# EAGLE design Traction_Control_Standalone (EAGLE 9.1.3)
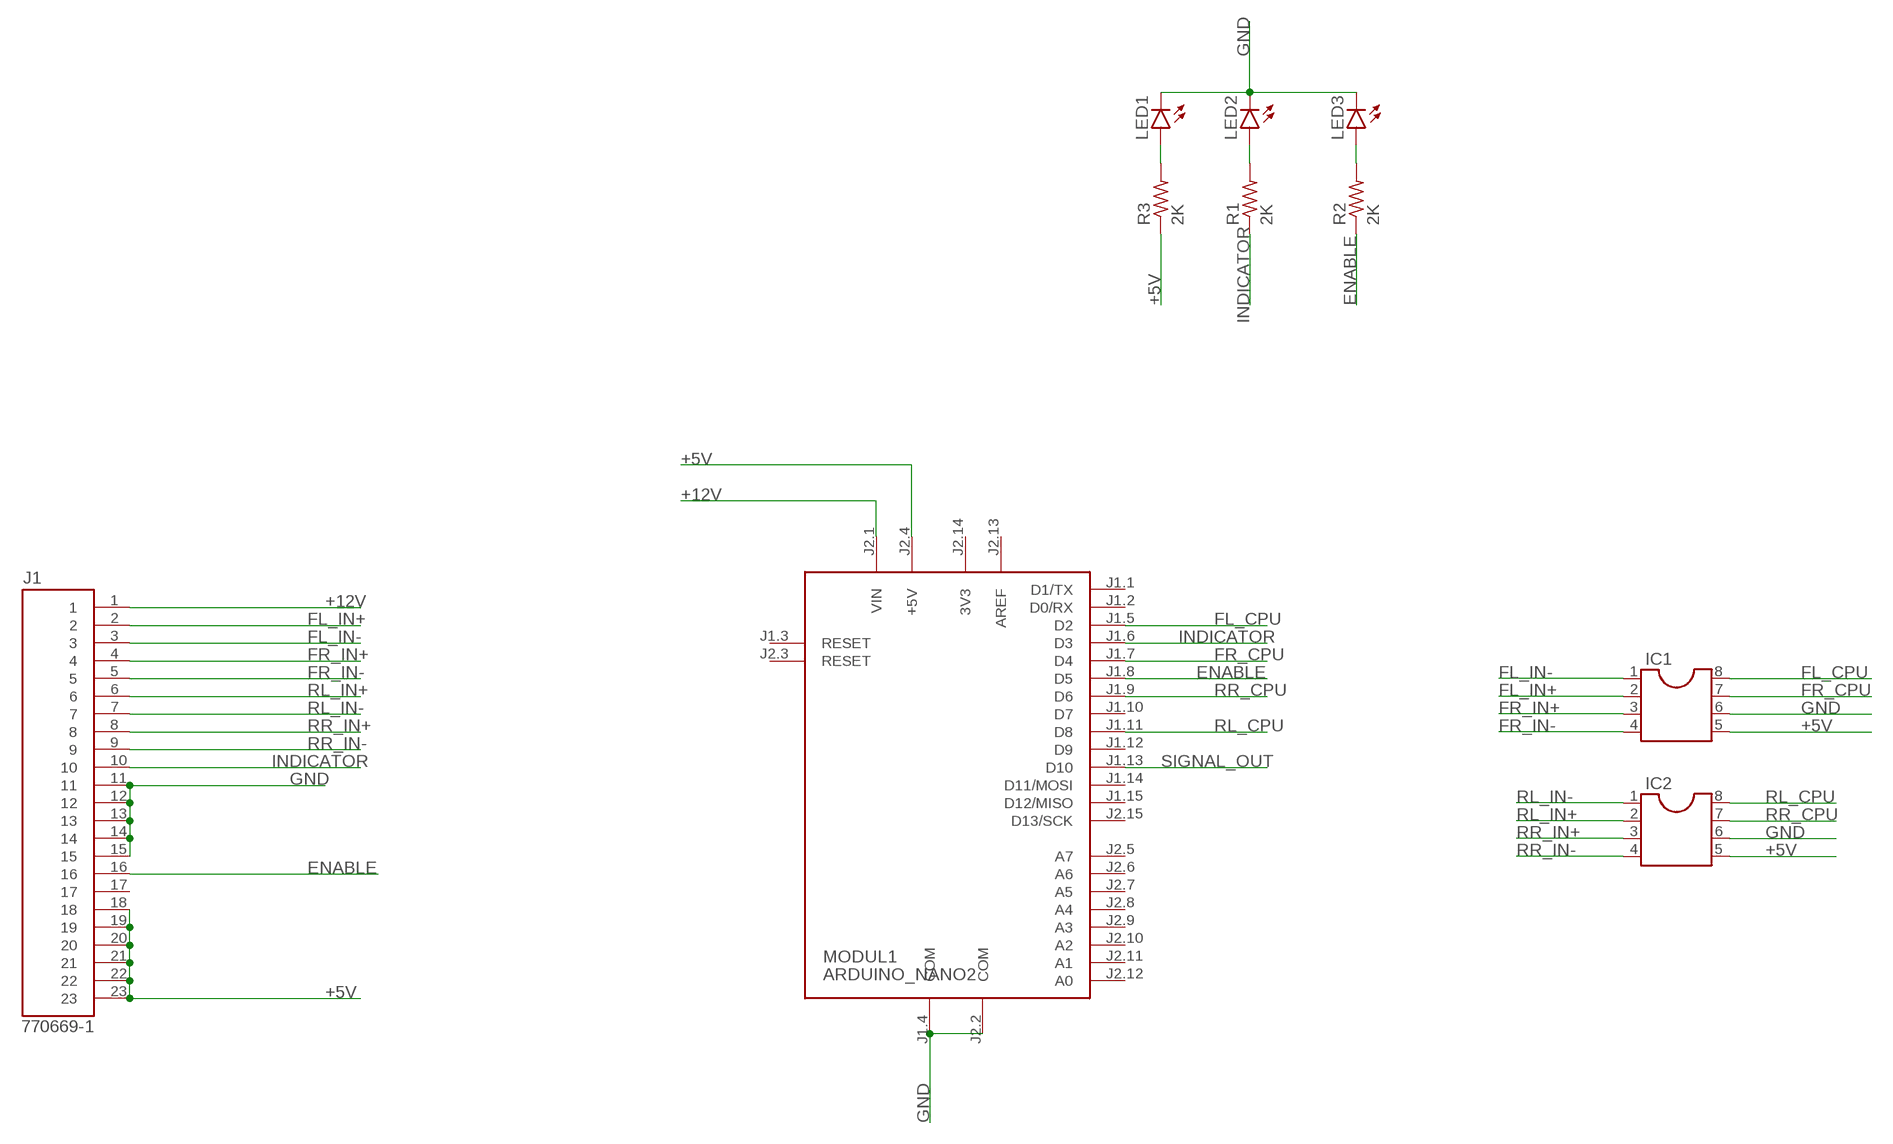
[diagram p0: schematic, sheet 1]

## Parts
IC1  DIL8S  [SOCKET-08]
IC2  DIL8S  [SOCKET-08]
J1  770669-1  [TE_770669-1]
LED1  LEDCHIP-LED0805  [CHIP-LED0805]
LED2  LEDCHIP-LED0805  [CHIP-LED0805]
LED3  LEDCHIP-LED0805  [CHIP-LED0805]
MODUL1  ARDUINO_NANO2  [ARDUINO_NANO2]
R1  2K  R-US_R0805  [R0805]
R2  2K  R-US_R0805  [R0805]
R3  2K  R-US_R0805  [R0805]

## Nets
+5V: IC1.5 IC2.5 J1.18 J1.19 J1.20 J1.21 J1.22 J1.23 MODUL1.J2.4(+5V) R3.1
+12V: J1.1 MODUL1.J2.1(VIN)
ENABLE: J1.16 MODUL1.J1.8(D5) R2.1
FL_CPU: IC1.8 MODUL1.J1.5(D2)
FL_IN+: IC1.2 J1.2
FL_IN-: IC1.1 J1.3
FR_CPU: IC1.7 MODUL1.J1.7(D4)
FR_IN+: IC1.3 J1.4
FR_IN-: IC1.4 J1.5
GND: IC1.6 IC2.6 J1.11 J1.12 J1.13 J1.14 J1.15 LED1.C LED2.C LED3.C MODUL1.J1.4(COM) MODUL1.J2.2(COM)
INDICATOR: J1.10 MODUL1.J1.6(D3) R1.1
N$1: LED1.A R3.2
N$2: LED2.A R1.2
N$3: LED3.A R2.2
RL_CPU: IC2.8 MODUL1.J1.11(D8)
RL_IN+: IC2.2 J1.6
RL_IN-: IC2.1 J1.7
RR_CPU: IC2.7 MODUL1.J1.9(D6)
RR_IN+: IC2.3 J1.8
RR_IN-: IC2.4 J1.9
SIGNAL_OUT: MODUL1.J1.13(D10)
Unconnected: J1.17 MODUL1.J1.1(D1/TX) MODUL1.J1.2(D0/RX) MODUL1.J1.3(RESET) MODUL1.J1.10(D7) MODUL1.J1.12(D9) MODUL1.J1.14(D11/MOSI) MODUL1.J1.15(D12/MISO) MODUL1.J2.3(RESET) MODUL1.J2.5(A7) MODUL1.J2.6(A6) MODUL1.J2.7(A5) MODUL1.J2.8(A4) MODUL1.J2.9(A3) MODUL1.J2.10(A2) MODUL1.J2.11(A1) MODUL1.J2.12(A0) MODUL1.J2.15(D13/SCK)

## Power pins joined to a net without a drawn wire
3V3: MODUL1.J2.14(3V3)
AREF: MODUL1.J2.13(AREF)

## Library data of the parts
IC1 IC2 = ic-package:DIL8: Dual In Line / Socket
J1 = 770669-1:770669-1: CONN HEADER 23POS R/A TIN BLK; AVAILABILITY: Unavailable; COMMENT: 770669-1; DESCRIPTION: AMPSEAL 23 Position Three Row Right Angle Snap Mount Pin Header; EU_ROHS_COMPLIANCE: Compliant; MF: TE Connectivity; MP: 770669-1; PACKAGE: None; PRICE: None; TE_PURCHASE_URL: https://www.te.com/usa-en/product-770669-1.html?te_bu=Cor&te_type=disp&te_campaign=seda_glo_cor-seda-global-disp-prtnr-fy19-seda-model-bom-cta_sma-317_1&elqCampaignId=32493
LED1-LED3 = led:LED: LED OSRAM: - CHIPLED LG R971, LG N971, LY N971, LG Q971, LY Q971, LO R971, LY R971 LH N974, LH R974 LS Q976, LO Q976, LY Q976 LO Q996 - Hyper CHIPLED LW Q18S LB Q993, LB Q99A, LB R99A - SideLED LS A670, LO A670, LY A670, LG A670, LP A670 LB A673, LV A673, LT A673, LW A673 LH A674 LY A675 LS A676, LA A676, LO A676, LY A676, LW A676 LS A679, LY A679, LG A679 - Hyper Micro SIDELED® LS Y876, LA Y876, LO Y876, LY Y876 LT Y87S - SmartLED LW L88C, LW L88S LB L89C, LB L89S, LG L890 LS L89K, LO L89K, LY L89K LS L896, LA L896, LO L896, LY L896 - TOPLED LS T670, LO T670, LY T670, LG T670, LP T670 LSG T670, LSP T670, LSY T670, LOP T670, LYG T670 LG T671, LOG T671, LSG T671 LB T673, LV T673, LT T673, LW T673 LH T674 LS T676, LA T676, LO T676, LY T676, LB T676, LH T676, LSB T676, LW T676 LB T67C, LV T67C, LT T67C, LS T67K, LO T67K, LY T67K, LW E67C LS E67B, LA E67B, LO E67B, LY E67B, LB E67C, LV E67C, LT E67C LW T67C LS T679, LY T679, LG T679 LS T770, LO T770, LY T770, LG T770, LP T770 LB T773, LV T773, LT T773, LW T773 LH T774 LS E675, LA E675, LY E675, LS T675 LS T776, LA T776, LO T776, LY T776, LB T776 LHGB T686 LT T68C, LB T68C - Hyper Mini TOPLED® LB M676 - Mini TOPLED Santana® LG M470 LS M47K, LO M47K, LY M47K Source: http://www.osram.convergy.de LUXEON: - LUMILED® LXK2-PW12-R00, LXK2-PW12-S00, LXK2-PW14-U00, LXK2-PW14-V00 LXK2-PM12-R00, LXK2-PM12-S00, LXK2-PM14-U00 LXK2-PE12-Q00, LXK2-PE12-R00, LXK2-PE12-S00, LXK2-PE14-T00, LXK2-PE14-U00 LXK2-PB12-K00, LXK2-PB12-L00, LXK2-PB12-M00, LXK2-PB14-N00, LXK2-PB14-P00, LXK2-PB14-Q00 LXK2-PR12-L00, LXK2-PR12-M00, LXK2-PR14-Q00, LXK2-PR14-R00 LXK2-PD12-Q00, LXK2-PD12-R00, LXK2-PD12-S00 LXK2-PH12-R00, LXK2-PH12-S00 LXK2-PL12-P00, LXK2-PL12-Q00, LXK2-PL12-R00 Source: www.luxeon.com KINGBRIGHT: KA-3528ASYC Source: www.kingbright.com
MODUL1 = arduino:ARDUINO_NANO2: Arduino Nano2 Auto generated by modulcreator.ulp \;; ANZAHL: 2; MODUL: TRUE; STECKX0: -76200; STECKX1: 76200; STECKY0: 177800; STECKY1: 177800
R1-R3 = rcl:R-US_: RESISTOR, American symbol; SPICEPREFIX: R

## Board
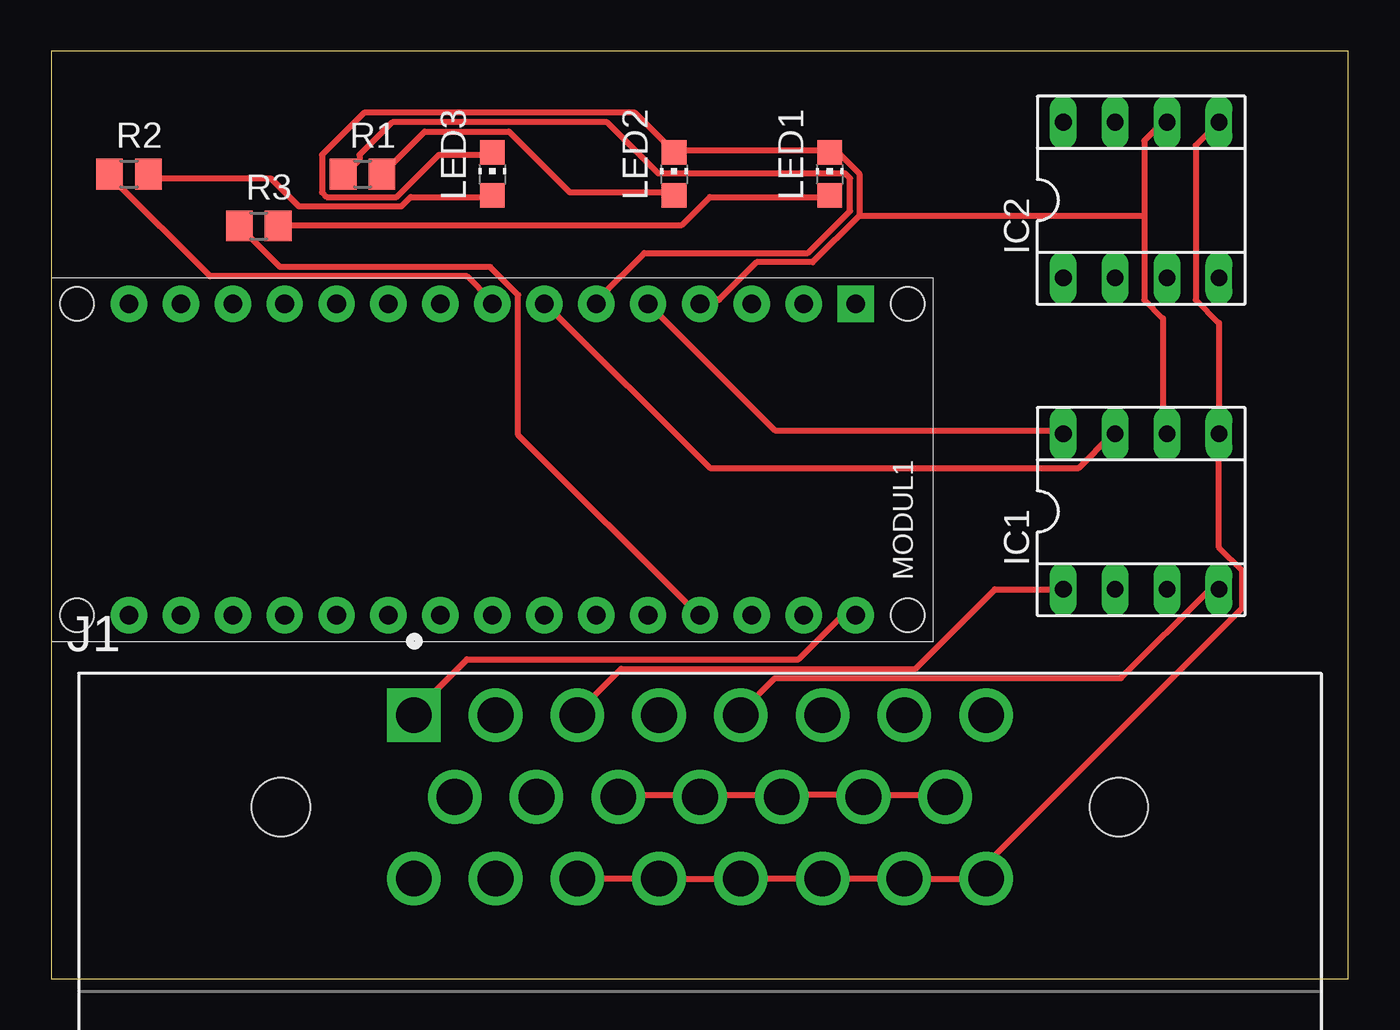
[diagram p1: board, top side]
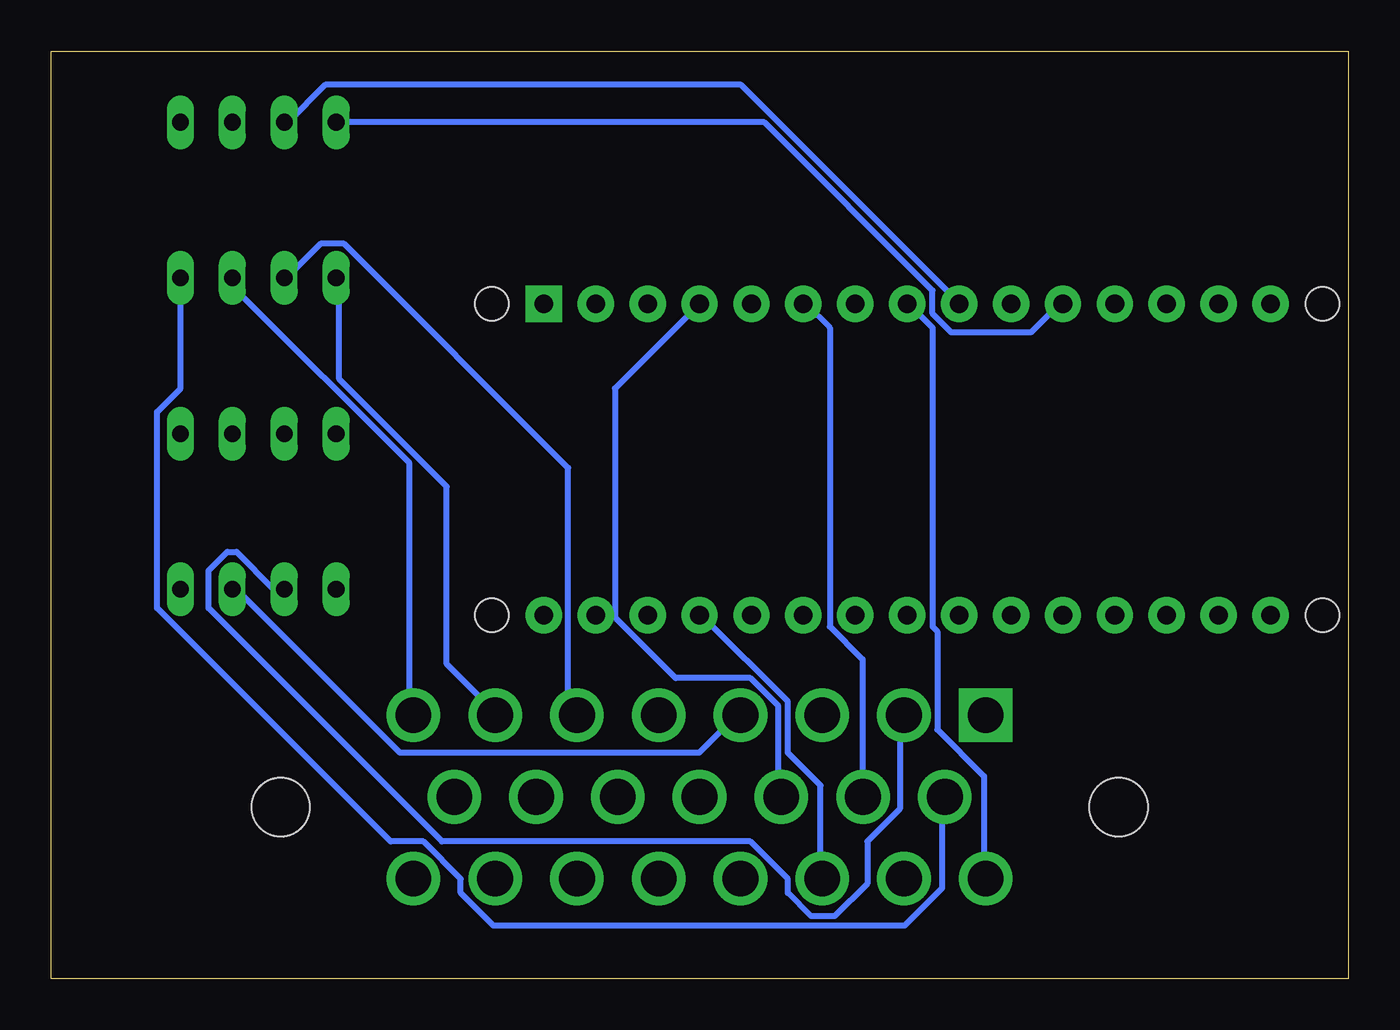
[diagram p2: board, bottom side, seen from below]

Size 63.48 x 45.39 mm. Coordinates in mm from the lower left corner, seen from the top.
Outline: 0,0 63.48,0 63.48,45.39 0,45.39 0,0
Copper layers (1*16): Top 0.035mm / dielectric 1.5mm / Bottom 0.035mm
Design rules "default *": minimum track width 12mil, minimum drill 0.35mm, track to track 6mil, track to pad 6mil, pad to pad 6mil, via to via 6mil, smd to smd 6mil, copper to edge 40mil, drill to drill 6mil, minimum pad ring 10mil, minimum via ring 8mil, stop-mask expansion 4mil, vias tented up to drill 0mil, thermal gap 10mil

### Footprints (pad centres in the part's own frame; a part is rotated, then mirrored left to right if it is on the bottom)
SOCKET-08 = drill 0.813 long: 1 -3.81,-3.81; 2 -1.27,-3.81; 3 1.27,-3.81; 4 3.81,-3.81; 5 3.81,3.81; 6 1.27,3.81; 7 -1.27,3.81; 8 -3.81,3.81
TE_770669-1 = drill 1.75 square: 1 -14,4 | drill 1.75: 2 -10,4; 3 -6,4; 4 -2,4; 5 2,4; 6 6,4; 7 10,4; 8 14,4; 9 -12,0; 10 -8,0; 11 -4,0; 12 0,0; 13 4,0; 14 8,0; 15 12,0; 16 -14,-4; 17 -10,-4; 18 -6,-4; 19 -2,-4; 20 2,-4; 21 6,-4; 22 10,-4; 23 14,-4 | hole 2.85: -20.5,-0.5; 20.5,-0.5
CHIP-LED0805 = smd 1.2 x 1.2: A 0,-1.05; C 0,1.05
ARDUINO_NANO2 = drill 0.914 pad 1.778 square: J1.1 -7.62,17.78 | drill 0.914 pad 1.778: J1.2 -7.62,15.24; J1.3 -7.62,12.7; J1.4 -7.62,10.16; J1.5 -7.62,7.62; J1.6 -7.62,5.08; J1.7 -7.62,2.54; J1.8 -7.62,0; J1.9 -7.62,-2.54; J1.10 -7.62,-5.08; J1.11 -7.62,-7.62; J1.12 -7.62,-10.16; J1.13 -7.62,-12.7; J1.14 -7.62,-15.24; J1.15 -7.62,-17.78; J2.1 7.62,17.78; J2.2 7.62,15.24; J2.3 7.62,12.7; J2.4 7.62,10.16; J2.5 7.62,7.62; J2.6 7.62,5.08; J2.7 7.62,2.54; J2.8 7.62,0; J2.9 7.62,-2.54; J2.10 7.62,-5.08; J2.11 7.62,-7.62; J2.12 7.62,-10.16; J2.13 7.62,-12.7; J2.14 7.62,-15.24; J2.15 7.62,-17.78 | hole 1.651: -7.62,-20.32; 7.62,-20.32; 7.62,20.32; -7.62,20.32
R0805 = smd 1.3 x 1.5: 1 -0.95,0; 2 0.95,0

### Placement (x,y rotation side)
IC1  53.34,22.86 0 top
IC2  53.34,38.1 0 top
J1  31.75,8.89 0 top
LED1  38.1,39.37 0 top
LED2  30.48,39.37 0 top
LED3  21.59,39.37 0 top
MODUL1  21.59,25.4 270 top
R1  15.24,39.37 0 top
R2  3.81,39.37 0 top
R3  10.16,36.83 0 top

### Tracks (layer width: path | path; a pad name or v marks a point on that pad's centre or on a via)
+5V
  Top 0.305: R3.1 9.37,36.65 11.2,34.82 21.49,34.82 22.86,33.45 22.86,26.59 31.55,17.91 MODUL1.J2.4 | J1.18 25.83,4.88 29.72,4.88 J1.19 29.95,4.88 33.6,4.88 J1.20 33.83,4.88 37.72,4.88 J1.21 37.95,4.88 41.6,4.88 J1.22 41.83,4.88 45.72,4.88 J1.23 45.95,5.1 45.95,5.79 58.29,18.14 58.29,19.96 57.15,21.11 IC1.5 57.15,32.08 56.01,33.22 56.01,40.77 IC2.5
  Bottom 0.305: MODUL1.J2.4 31.55,17.68 27.43,13.56 27.43,11.05 25.83,9.45 25.83,5.1 J1.18
+12V
  Top 0.305: MODUL1.J2.1 39.32,17.68 38.63,17.68 36.58,15.62 20.34,15.62 17.83,13.11 J1.1
ENABLE
  Top 0.305: R2.1 2.97,39.17 7.77,34.37 20.34,34.37 21.49,33.22 MODUL1.J1.8
  Bottom 0.305: J1.16 17.83,5.1 17.83,9.91 20.12,12.19 20.12,16.99 20.34,17.22 20.34,31.85 21.49,32.99 MODUL1.J1.8
FL_CPU
  Top 0.305: IC1.8 49.38,26.82 35.43,26.82 29.26,32.99 MODUL1.J1.5
FL_IN+
  Bottom 0.305: IC1.2 52.58,19.05 54.41,20.88 54.86,20.88 55.78,19.96 55.78,18.14 44.35,6.71 29.26,6.71 27.43,4.88 27.43,4.19 26.29,3.05 25.15,3.05 23.55,4.65 23.55,6.71 21.95,8.31 21.95,12.88 J1.2
FL_IN-
  Top 0.305: IC1.1 46.18,19.05 42.29,15.16 27.89,15.16 25.83,13.11 J1.3
FR_CPU
  Top 0.305: IC1.7 51.89,26.59 50.29,24.99 32.23,24.99 24.23,32.99 MODUL1.J1.7
FR_IN+
  Bottom 0.305: IC1.3 54.41,19.05 46.41,11.05 31.77,11.05 29.95,12.88 J1.4
FR_IN-
  Top 0.305: IC1.4 56.69,19.05 52.35,14.71 35.43,14.71 33.83,13.11 J1.5
GND
  Top 0.305: J1.15 43.66,8.99 39.78,8.99 J1.14 39.55,8.99 35.89,8.99 J1.13 35.66,8.99 31.77,8.99 J1.12 31.55,8.99 27.89,8.99 J1.11 | 53.49,37.34 53.49,41 54.41,41.91 IC2.6 | 53.49,37.34 53.49,33.22 54.41,32.31 54.41,26.82 IC1.6 | LED3.C 21.49,40.31 18.97,40.31 16.92,38.25 13.49,38.25 13.26,38.48 13.26,40.31 15.32,42.37 28.57,42.37 30.4,40.54 LED2.C 30.63,40.54 37.95,40.54 LED1.C 38.18,40.31 38.63,40.31 39.55,39.39 39.55,37.34 | 39.55,37.34 37.26,35.05 34.52,35.05 32.69,33.22 31.77,33.22 MODUL1.J1.4 | 39.55,37.34 53.49,37.34
  Bottom 0.305: 35.89,17.68 36.8,17.68 MODUL1.J2.2 | 35.89,17.68 32.92,14.71 29.26,14.71 27.89,13.33 27.89,8.99 J1.11 | 35.89,17.68 35.89,28.88 MODUL1.J1.4
INDICATOR
  Top 0.305: R1.1 14.4,39.39 15.09,40.08 15.09,40.31 16.69,41.91 27.2,41.91 29.72,39.39 38.86,39.39 39.09,39.17 39.09,37.57 37.03,35.51 29.03,35.51 26.75,33.22 MODUL1.J1.6
  Bottom 0.305: J1.10 23.77,8.99 23.77,15.62 25.38,17.22 25.38,31.85 26.52,32.99 MODUL1.J1.6
N$1
  Top 0.305: LED1.A 37.95,38.25 32.23,38.25 30.86,36.88 11.2,36.88 R3.2
N$2
  Top 0.305: LED2.A 30.4,38.48 25.38,38.48 22.4,41.45 18.29,41.45 16.23,39.39 R1.2
N$3
  Top 0.305: LED3.A 21.49,38.25 17.6,38.25 17.14,37.79 12.12,37.79 10.74,39.17 4.8,39.17 R2.2
RL_CPU
  Bottom 0.305: IC2.8 28.57,41.91 20.34,33.68 20.34,32.54 19.43,31.62 15.54,31.62 14.17,32.99 MODUL1.J1.11
RL_IN+
  Bottom 0.305: IC2.2 51.89,34.37 50.29,35.97 49.15,35.97 38.18,24.99 38.18,13.33 37.95,13.11 J1.6
RL_IN-
  Bottom 0.305: IC2.1 49.38,34.14 49.38,29.34 44.12,24.08 44.12,15.39 41.83,13.11 J1.7
RR_CPU
  Bottom 0.305: IC2.7 51.89,41.91 50.06,43.74 29.72,43.74 19.2,33.22 MODUL1.J1.9
RR_IN+
  Bottom 0.305: IC2.3 54.41,34.14 54.41,33.68 45.95,25.22 45.95,13.11 J1.8
RR_IN-
  Bottom 0.305: IC2.4 57.15,28.88 58.29,27.74 58.29,18.14 46.86,6.71 45.26,6.71 43.43,4.88 43.43,4.19 41.83,2.59 21.72,2.59 19.89,4.42 19.89,8.76 J1.9